# EAGLE design mod_sens (EAGLE 9.6.2)
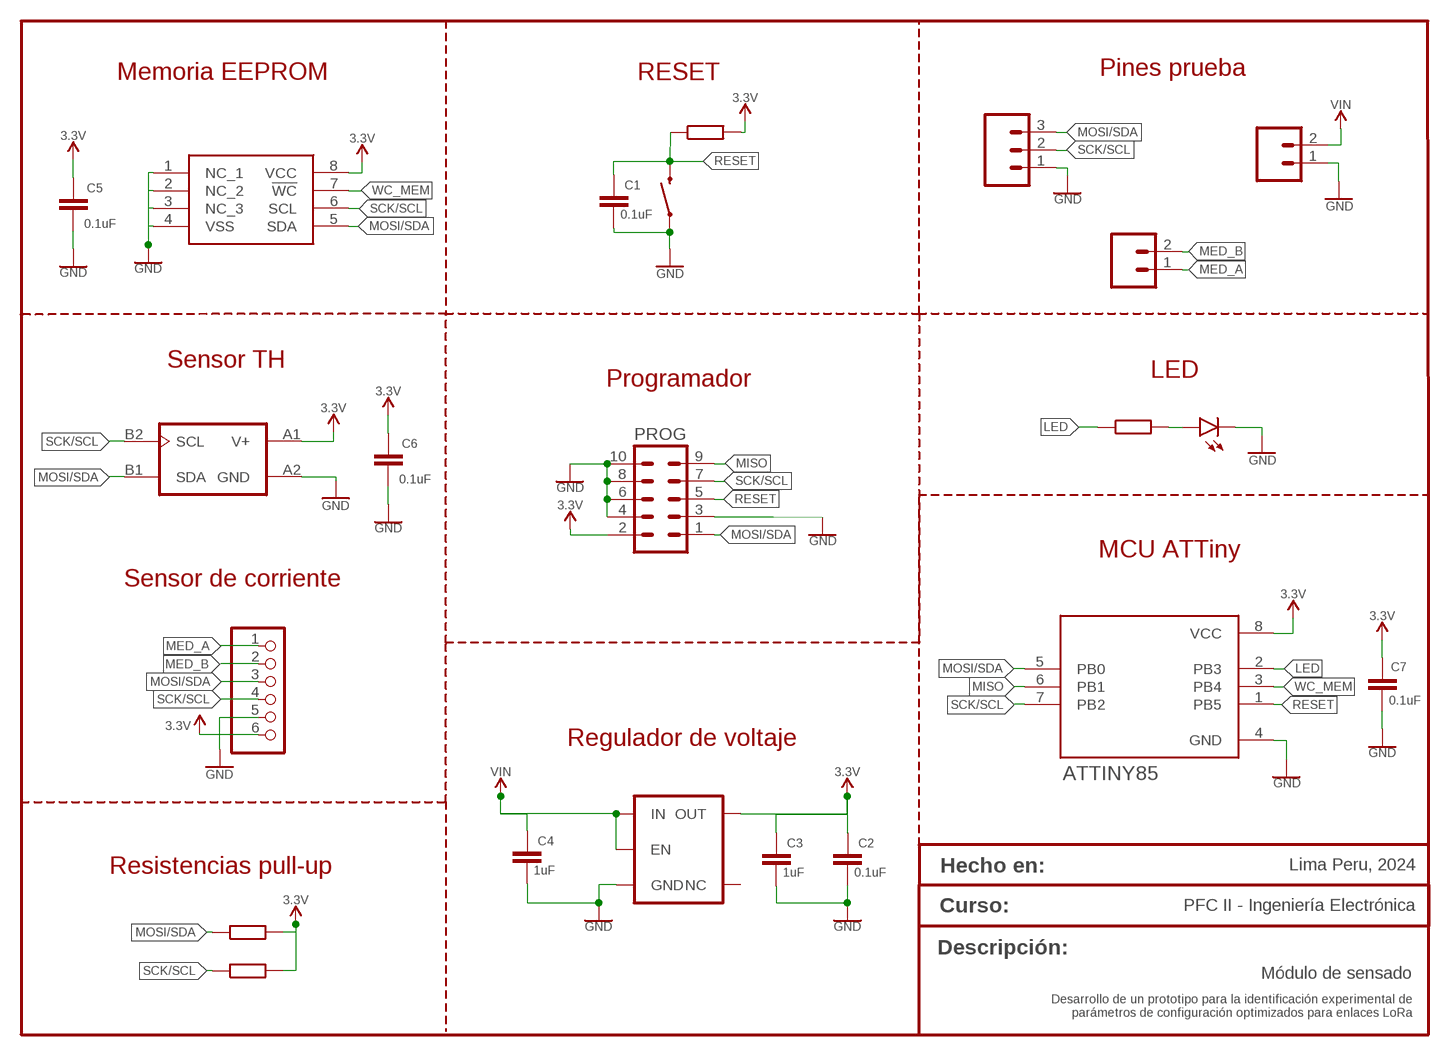
[diagram p0: schematic, sheet 1]

## Parts
ATTINY85  ATTINY85  ATTINY85-20SU  [SOIC127P798X216-8N]
C1  0.1uF  C-EUC0603K  [C0603K]
C2  0.1uF  C-EUC0603K  [C0603K]
C3  1uF  C-EUC0603K  [C0603K]
C4  1uF  C-EUC0603K  [C0603K]
C5  0.1uF  0.1UF-0603-25V-(+80/-20%)  [0603]
C6  0.1uF  0.1UF-0603-25V-(+80/-20%)  [0603]
C7  0.1uF  0.1UF-0603-25V-(+80/-20%)  [0603]
CURR  curr  CONN_02  [1X02]
CURR1  curr  CONN_02  [1X02]
I2C  i2c  CONN_03  [1X03]
L_ON  LED_3MM  [LEDRD254W50D405H1055]
MEMORIA  M24M01E  M24M01E-FMN6TP  [SOIC127P600X175-8N]
PROG  ML10-3M  [3M_10]
R1  68  R-EU_0207/10  [0207/10]
R2  1.5k  R-EU_0207/10  [0207/10]
R3  1.5k  R-EU_0207/10  [0207/10]
R4  10k  R-EU_0207/10  [0207/10]
RESET  MOMENTARY-SWITCH-SPST-PTH-6.0MM  [TACTILE_SWITCH_PTH_6.0MM]
SENSOR_CURR  sens_curr  PINHD-1X6  [1X06]
SENSOR_TH  TMP103GYFFR  [IC_TMP103DYFFR]
VOLT  3.3V  V_REG_AP2112K-3.3V  [SOT23-5]

## Nets
3.3V: ATTINY85.8(VCC) C2.1 C3.1 C5.1 C6.1 C7.1 MEMORIA.8(VCC) PROG.2 R2.2 R3.2 R4.2 SENSOR_CURR.6 SENSOR_TH.A1(V+) VOLT.5(OUT)
GND: ATTINY85.4(GND) C1.2 C2.2 C3.2 C4.2 C5.2 C6.2 C7.2 CURR1.1 I2C.1 L_ON.C MEMORIA.1(NC_1) MEMORIA.2(NC_2) MEMORIA.3(NC_3) MEMORIA.4(VSS) PROG.3 PROG.4 PROG.6 PROG.8 PROG.10 RESET.1 SENSOR_CURR.5 SENSOR_TH.A2(GND) VOLT.2(GND)
LED: ATTINY85.2(PB3) R1.1
MED_A: CURR.1 SENSOR_CURR.1
MED_B: CURR.2 SENSOR_CURR.2
MISO: ATTINY85.6(PB1) PROG.9
MOSI/SDA: ATTINY85.5(PB0) I2C.3 MEMORIA.5(SDA) PROG.1 R2.1 SENSOR_CURR.3 SENSOR_TH.B1(SDA)
N$1: L_ON.A R1.2
RESET: ATTINY85.1(PB5) C1.1 PROG.5 R4.1 RESET.3
SCK/SCL: ATTINY85.7(PB2) I2C.2 MEMORIA.6(SCL) PROG.7 R3.1 SENSOR_CURR.4 SENSOR_TH.B2(SCL)
VIN [power]: C4.1 CURR1.2 VOLT.1(IN) VOLT.3(EN)
WC_MEM: ATTINY85.3(PB4) MEMORIA.7(!WC)
Unconnected: VOLT.4(NC)

## Notes on the sheet
- Memoria EEPROM | RESET | Pines prueba
- Sensor TH
- LED
- Programador
- MCU ATTiny
- Sensor de corriente
- Regulador de voltaje
- Resistencias pull-up
- Hecho en: | Lima Peru, 2024
- Curso: | PFC II - Ingeniería Electrónica
- Descripción:
- Módulo de sensado
- Desarrollo de un prototipo para la identificación experimental de
  parámetros de configuración optimizados para enlaces LoRa

## Library data of the parts
ATTINY85 = ATTINY85-20SU:ATTINY85-20SU: AVR AVR® ATtiny, Functional Safety (FuSa) Microcontroller IC 8-Bit 20MHz 8KB (4K x 16) FLASH 8-SOIC Check availability <https://pricing.snapeda.com/parts/ATTINY85-20SU/Microchip/view-part?ref=eda>; AVAILABILITY: In Stock; CHECK_PRICES: https://www.snapeda.com/parts/ATTINY85-20SU/Microchip/view-part/?ref=eda; DESCRIPTION: AVR AVR® ATtiny, Functional Safety (FuSa) Microcontroller IC 8-Bit 20MHz 8KB (4K x 16) FLASH 8-SOIC; MF: Microchip; MP: ATTINY85-20SU; PACKAGE: SOIC-8 Microchip; PRICE: None; SNAPEDA_LINK: https://www.snapeda.com/parts/ATTINY85-20SU/Microchip/view-part/?ref=snap
C1-C4 = rcl:C-EU: CAPACITOR, European symbol; SPICEPREFIX: C
C5-C7 = SparkFun-Capacitors:0.1UF: 0.1µF ceramic capacitors A capacitor is a passive two-terminal electrical component used to store electrical energy temporarily in an electric field.; PROD_ID: CAP-00810
CURR CURR1 = SparkFun-Connectors:CONN_02: Multi connection point. Often used as Generic Header-pin footprint for 0.1 inch spaced/style header connections On any of the 0.1 inch spaced packages, you can populate with these: Break Away Headers - Straight <https://www.sparkfun.com/products/116> (PRT-00116) Break Away Male Headers - Right Angle <https://www.sparkfun.com/products/553> (PRT-00553) Female Headers <https://www.sparkfun.com/products/115> (PRT-00115) Break Away Headers - Machine Pin <https://www.sparkfun.com/products/117> (PRT-00117) Break Away Female Headers - Swiss Machine Pin <https://www.sparkfun.com/products/743> (PRT-00743) For SCREWTERMINALS and SPRING TERMINALS visit here: Screw Terimnals on SparkFun.com <https://www.sparkfun.com/search/results?term=Screw+Terminals> (5mm/3.5mm/2.54mm spacing) This device is also useful as a general connection point to wire up your design to another part of your project. Our various solder wires solder well into these plated through hole pads. Hook-Up Wire - Assortment (Stranded, 22 AWG) <https://www.sparkfun.com/products/11375> (PRT-11375) Hook-Up Wire - Assortment (Solid Core, 22 AWG) <https://www.sparkfun.com/products/11367> (PRT-11367) View the entire wire category on our website here <https://www.sparkfun.com/categories/141> Special notes: Molex polarized connector foot print use with: PRT-08233 with associated crimp pins and housings. 2.54_SCREWTERM for use with PRT-10571. 3.5mm Screw Terminal footprints for PRT-08084 5mm Screw Terminal footprints for use with PRT-08432
I2C = SparkFun-Connectors:CONN_03: Multi connection point. Often used as Generic Header-pin footprint for 0.1 inch spaced/style header connections On any of the 0.1 inch spaced packages, you can populate with these: Break Away Headers - Straight <https://www.sparkfun.com/products/116> (PRT-00116) Break Away Male Headers - Right Angle <https://www.sparkfun.com/products/553> (PRT-00553) Female Headers <https://www.sparkfun.com/products/115> (PRT-00115) Break Away Headers - Machine Pin <https://www.sparkfun.com/products/117> (PRT-00117) Break Away Female Headers - Swiss Machine Pin <https://www.sparkfun.com/products/743> (PRT-00743) Stackable Header - 3 Pin (Female, 0.1") <https://www.sparkfun.com/products/13875> (PRT-13875) For SCREWTERMINALS and SPRING TERMINALS visit here: Screw Terimnals on SparkFun.com <https://www.sparkfun.com/search/results?term=Screw+Terminals> (5mm/3.5mm/2.54mm spacing) This device is also useful as a general connection point to wire up your design to another part of your project. Our various solder wires solder well into these plated through hole pads. Hook-Up Wire - Assortment (Stranded, 22 AWG) <https://www.sparkfun.com/products/11375> (PRT-11375) Hook-Up Wire - Assortment (Solid Core, 22 AWG) <https://www.sparkfun.com/products/11367> (PRT-11367) View the entire wire category on our website here <https://www.sparkfun.com/categories/141> Special notes: Molex polarized connector foot print use with SKU : PRT-08232 with associated crimp pins and housings.; PROD_ID: XXX-00000; VALUE: 455-1750-1-ND
L_ON = LED_3MM:LED_3MM
MEMORIA = M24M01E-FMN6TP:M24M01E-FMN6TP: 1 Mbit Serial I2C bus EEPROM with configurable device address and software write protection registers Source: Datasheet <https://www.st.com/resource/en/datasheet/m24m01e-f.pdf>; DESCRIPTION: 1 Mbit Serial I2C bus EEPROM with configurable device address and software write protection registers; HEIGHT: 1.75mm; MANUFACTURER_NAME: STMicroelectronics; MANUFACTURER_PART_NUMBER: M24M01E-FMN6TP; MOUSER_PART_NUMBER: 511-M24M01E-FMN6TP; MOUSER_PRICE-STOCK: https://www.mouser.co.uk/ProductDetail/STMicroelectronics/M24M01E-FMN6TP?qs=1Kr7Jg1SGW8I5RljfIUeLw%3D%3D
PROG = con-harting-ml:ML10: HARTING; OC_FARNELL: unknown; OC_NEWARK: unknown
R1-R4 = rcl:R-EU_: RESISTOR, European symbol; SPICEPREFIX: R
RESET = SparkFun-Switches:MOMENTARY-SWITCH-SPST: Momentary Switch (Pushbutton) - SPST Normally-open (NO) SPST momentary switches (buttons, pushbuttons). Variants PTH-12MM - 12mm square, through-hole Momentary Pushbutton Switch - 12mm Square <https://www.sparkfun.com/products/9190> (COM-09190) PTH-6.0MM, PTH-6.0MM-KIT - 6.0mm square, through-hole Mini Pushbutton Switch <https://www.sparkfun.com/products/97> (COM-00097) KIT package intended for soldering kit's - only one side of pads' copper is exposed. PTH-RIGHT-ANGLE-KIT - Right-angle, through-hole Right Angle Tactile Button <https://www.sparkfun.com/products/10791> - Used on SparkFun BigTime Watch Kit <https://www.sparkfun.com/products/11734> SMD-12MM - 12mm square, surface-mount Tactile Button - SMD (12mm) <https://www.sparkfun.com/products/12993> (COM-12993) Used on SparkFun PicoBoard <https://www.sparkfun.com/products/11888> SMD-4.5MM - 4.5mm Square Trackball Switch Used on SparkFun Blackberry Trackballer Breakout <https://www.sparkfun.com/products/13169> SMD-4.6MMX2.8MM - 4.60mm x 2.80mm, surface mount Used on SparkFun Pro Micro - RP2040 <https://www.sparkfun.com/products/17717> SMD-5.2MM, SMD-5.2-REDUNDANT - 5.2mm square, surface-mount Mini Pushbutton Switch - SMD <https://www.sparkfun.com/products/8720> (COM-08720) Used on Arduino Pro Mini <https://www.sparkfun.com/products/11114> REDUNDANT package connects both switch circuits together SMD-6.0X3.5MM - 6.0 x 3.5mm, surface mount Momentary Reset Switch SMD <https://www.sparkfun.com/products/8229> (COM-08229) SMD-6.2MM-TALL - 6.2mm square, surface mount Tactile Button - SMD (6mm) <https://www.sparkfun.com/products/12992> Used on SparkFun Digital Sandbox <https://www.sparkfun.com/products/12651> SMD-RIGHT-ANGLE - Right-angle, surface mount Used on SparkFun Block for Intel® Edison - Arduino <https://www.sparkfun.com/products/13036>; PROD_ID: SWCH-08441; SF_SKU: COM-00097
SENSOR_CURR = pinhead:PINHD-1X6: PIN HEADER
SENSOR_TH = TMP103GYFFR:TMP103GYFFR: None Check availability <https://pricing.snapeda.com/parts/TMP103GYFFR/Texas%20Instruments/view-part?ref=eda>; AVAILABILITY: In Stock; CHECK_PRICES: https://www.snapeda.com/parts/TMP103GYFFR/Texas+Instruments/view-part/?ref=eda; DESCRIPTION: &plusmn;2&deg;C Digital temperature sensor with I2C/SMBus capable of 1.4V in WCSP; MF: Texas Instruments; MP: TMP103GYFFR; PACKAGE: BGA-4 Texas Instruments; PRICE: None; PURCHASE-URL: https://www.snapeda.com/api/url_track_click_mouser/?unipart_id=4805950&manufacturer=Texas Instruments&part_name=TMP103GYFFR&search_term=None; SNAPEDA_LINK: https://www.snapeda.com/parts/TMP103GYFFR/Texas+Instruments/view-part/?ref=snap
VOLT = SparkFun-IC-Power:V_REG_AP2112: AP2112 - 600mA CMOS LDO Regulator w/ Enable The AP2112 is CMOS process low dropout linear regulator with enable function, the regulator delivers a guaranteed 600mA (min.) continuous load current. Features Output Voltage Accuracy: ±1.5% Output Current: 600mA (Min.) Foldback Short Current Protection: 50mA Enable Function to Turn ON/OFF VOUT Low Dropout Voltage (3.3V): 250mV (Typ.) @IOUT=600mA Excellent Load Regulation: 0.2%/A (Typ.) Excellent Line Regulation: 0.02%/V (Typ.) Low Quiescent Current: 55μA (Typ.) Low Standby Current: 0.01μA (Typ.) Low Output Noise: 50μVRMS PSRR: 100Hz -65dB, 1kHz -65dB OTSD Protection Stable with 1.0μF Flexible Cap: Ceramic, Tantalum and Aluminum Electrolytic Operation Temperature Range: -40°C to 85°C ESD: MM 400V, HBM 4000V; PROD_ID: VREG-12457

## Net classes
1 power: width 0.305 mm

## Board
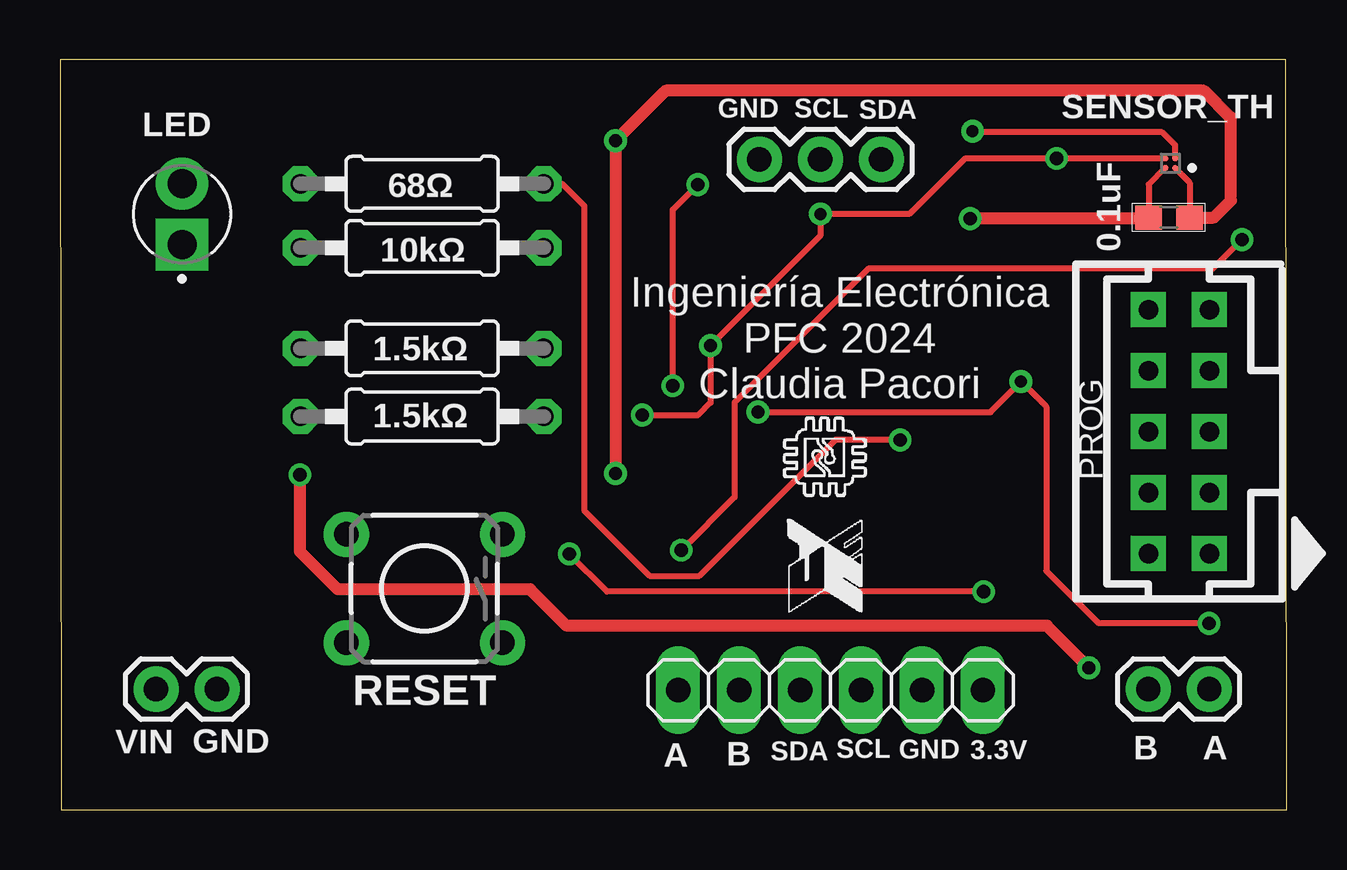
[diagram p1: board, top side]
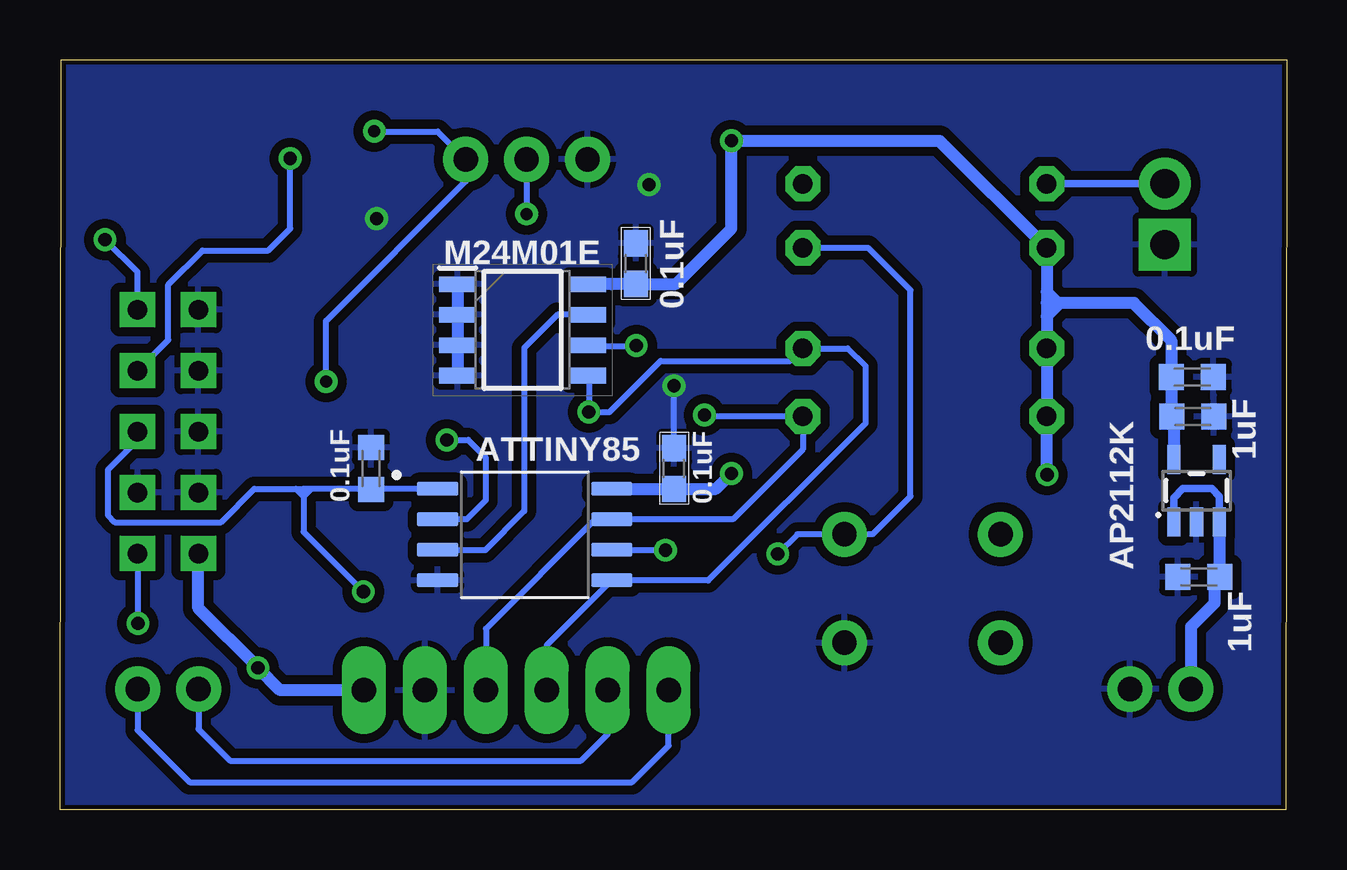
[diagram p2: board, bottom side, seen from below]

Size 51.14 x 31.26 mm. Coordinates in mm from the lower left corner, seen from the top.
Outline: 0.04,0 51.14,0 51.1,31.26 0,31.26 0.04,0
Copper layers (1*16): Top 0.035mm / dielectric 1.6mm / Bottom 0.035mm
Design rules "jlcpcb-2layers_my *": minimum track width 5mil, minimum drill 0.2mm, track to track 15mil, track to pad 15mil, pad to pad 15mil, via to via 15mil, smd to smd 5mil, copper to edge 0.2mm, drill to drill 10mil, minimum pad ring 10mil, minimum via ring 3mil, stop-mask expansion 4mil, vias tented up to drill 0.2mm, thermal gap 10mil

### Footprints (pad centres in the part's own frame; a part is rotated, then mirrored left to right if it is on the bottom)
SOIC127P798X216-8N = smd 1.71 x 0.58: 1 -3.63,1.905; 2 -3.63,0.635; 3 -3.63,-0.635; 4 -3.63,-1.905; 5 3.63,-1.905; 6 3.63,-0.635; 7 3.63,0.635; 8 3.63,1.905
C0603K = smd 1.05 x 1.08: 1 -0.875,0; 2 0.875,0
0603 = smd 1.1 x 1: 1 -0.85,0; 2 0.85,0
1X02 = drill 1.016 pad 1.88: 1 0,0; 2 2.54,0
1X03 = drill 1.016 pad 1.88: 1 0,0; 2 2.54,0; 3 5.08,0
LEDRD254W50D405H1055 = drill 1.21: A 1.27,0 | drill 1.21 square: C -1.27,0
SOIC127P600X175-8N = smd 1.525 x 0.65: 1 -2.712,1.905; 2 -2.712,0.635; 3 -2.712,-0.635; 4 -2.712,-1.905; 5 2.712,-1.905; 6 2.712,-0.635; 7 2.712,0.635; 8 2.712,1.905
3M_10 = drill 0.813 square: 1 -5.08,-1.27; 2 -5.08,1.27; 3 -2.54,-1.27; 4 -2.54,1.27; 5 0,-1.27; 6 0,1.27; 7 2.54,-1.27; 8 2.54,1.27; 9 5.08,-1.27; 10 5.08,1.27
0207/10 = drill 0.813 octagon: 1 -5.08,0; 2 5.08,0
TACTILE_SWITCH_PTH_6.0MM = drill 1.016 pad 1.88: 1 -3.251,2.261; 2 3.251,2.261; 3 -3.251,-2.261; 4 3.251,-2.261
1X06 = drill 1.016 long: 1 -6.35,0; 2 -3.81,0; 3 -1.27,0; 4 1.27,0; 5 3.81,0; 6 6.35,0
IC_TMP103DYFFR = smd 0.23 x 0.23: A1 -0.2,0.2; A2 0.2,0.2; B1 -0.2,-0.2; B2 0.2,-0.2
SOT23-5 = smd 0.55 x 1.2: 1 -0.95,-1.3; 2 0,-1.3; 3 0.95,-1.3; 4 0.95,1.3; 5 -0.95,1.3

### Placement (x,y rotation side)
ATTINY85  31.77,11.47 0 bottom
C1  38.18,14.23 90 bottom
C2  3.95,18.04 0 bottom
C3  3.92,16.39 0 bottom
C4  3.67,9.71 180 bottom
C5  27.14,22.77 90 bottom
C6  46.23,24.69 180 top
C7  25.54,14.22 90 bottom
CURR  47.9,5.03 180 top
CURR1  6.54,5.03 180 top
I2C  29.15,27.11 0 top
L_ON  5.09,24.83 90 top
MEMORIA  31.86,20 0 bottom
PROG  46.64,15.76 90 top
R1  15.09,26.09 180 top
R2  15.09,19.23 180 top
R3  15.09,16.39 180 top
R4  15.09,23.42 180 top
RESET  15.19,9.22 180 top
SENSOR_CURR  32.12,4.98 0 top
SENSOR_TH  46.28,26.95 180 top
VOLT  3.77,13.3 0 bottom

### Tracks (layer width: path | path; a pad name or v marks a point on that pad's centre or on a via)
3.3V  (via drill 0.55 pad 0.95)
  Top 0.254: SENSOR_TH.A1 47.09,26.14 47.09,24.71 C6.1
  Top 0.508: C6.1 48.1,24.69 48.81,25.4 48.81,28.85 47.69,29.97 25.24,29.97 v23.16,27.89 23.16,27.88 23.16,14.03 v23.16,14.02 | v42.89,5.92 41.14,7.67 21.12,7.67 19.6,9.2 11.57,9.2 10,10.77 v10,13.97
  Bottom 0.508: 10.01,21.59 R4.2 14.48,27.89 v23.16,27.89 23.16,24.23 25.47,21.92 C5.1 28.15,21.91 MEMORIA.8 | 10.01,21.59 10.01,21.13 | 10.01,21.13 10.01,20.57 | 10.01,20.57 R2.2 R3.2 10,16.38 v10,13.97 | 10.01,21.13 9.55,21.13 | 9.46,21.13 6.38,21.13 4.82,19.57 C2.1 4.82,16.42 C3.1 4.72,16.32 VOLT.5 | 10.01,21.59 9.55,21.13 | 9.55,21.13 9.46,21.13 | 10.01,20.57 9.46,21.13 | ATTINY85.8 C7.1 23.8,13.37 v23.16,14.02 | SENSOR_CURR.6 41.95,4.98 v42.89,5.92 45.37,8.4 PROG.2
GND  (via drill 0.55 pad 0.95)
  Top 0.254: SENSOR_TH.A2 46.06,26.75 45.38,26.07 C6.2 | v25.54,17.68 25.54,25.02 v26.58,26.06
  Top 0.508: C6.2 45.32,24.64 v37.94,24.64
  Bottom 0.254: C7.2 v25.54,17.68
  Bottom 0.508: MEMORIA.1 MEMORIA.2 MEMORIA.3 MEMORIA.4
  pour Bottom: -0.72,32 -0.72,-1.42 52.31,-1.42 52.31,32
LED  (via drill 0.55 pad 0.95)
  Top 0.254: v35.02,15.42 32.32,15.42 26.66,9.75 24.58,9.75 21.85,12.48 21.85,25.18 20.94,26.09 R1.1
  Bottom 0.254: ATTINY85.2 34.19,12.11 33.39,12.9 33.39,14.68 34.13,15.42 v35.02,15.42
MED_A
  Bottom 0.254: CURR.1 47.9,3.31 45.74,1.15 27.29,1.15 25.77,2.67 SENSOR_CURR.1
MED_B
  Bottom 0.254: CURR.2 45.36,3.37 45.37,3.37 44.05,2.04 29.42,2.04 28.31,3.15 SENSOR_CURR.2
MISO  (via drill 0.55 pad 0.95)
  Top 0.254: v49.27,23.77 48.05,22.55 33.69,22.55 28.12,16.98 28.12,13.04 v25.9,10.82
  Bottom 0.254: ATTINY85.6 25.91,10.84 v25.9,10.82 | PROG.9 47.91,22.42 v49.27,23.77
MOSI/SDA  (via drill 0.5 pad 0.95, 0.55 pad 0.95)
  Top 0.254: v38.04,28.3 38.09,28.25 45.95,28.25 46.48,27.71 SENSOR_TH.B1 | v29.1,16.58 38.78,16.58 v40.05,17.85 40.08,17.85 41.11,16.82 41.11,9.96 43.3,7.77 v47.9,7.77
  Bottom 0.254: v38.04,28.3 38.02,28.27 35.39,28.27 I2C.3 34.23,26.2 40.05,20.38 v40.05,17.85 | MEMORIA.5 29.1,18.05 v29.1,16.58 28.24,16.58 26.1,18.71 20.7,18.71 R2.1 18.31,19.23 17.57,18.49 17.57,16.1 24.12,9.55 28.13,9.55 ATTINY85.5 30.85,6.86 SENSOR_CURR.3 | PROG.1 47.91,7.79 v47.9,7.77
N$1
  Bottom 0.254: R1.2
  Bottom 0.305: L_ON.A R1.2
RESET  (via drill 0.55 pad 0.95)
  Top 0.254: v38.5,9.09 22.8,9.09 v21.23,10.67
  Bottom 0.254: R4.1 17.45,23.43 15.69,21.66 15.69,13.07 17.27,11.48 RESET.3 20.41,11.48 v21.23,10.67 | ATTINY85.1 38.14,13.38 | 38.14,13.38 C1.1 | 41.31,13.38 43.04,13.38 44.43,11.98 48.85,11.98 49.15,12.28 49.15,14.17 47.91,15.41 PROG.5 | 41.31,13.38 40.99,13.38 | 38.14,13.38 40.67,13.38 | 40.67,13.38 40.99,13.38 | 40.99,13.38 40.99,13.06 | 40.99,13.06 40.99,11.58 v38.5,9.09 | 40.99,13.06 40.67,13.38 | 40.99,13.06 41.31,13.38
SCK/SCL  (via drill 0.5 pad 0.95, 0.55 pad 0.95)
  Top 0.254: SENSOR_TH.B2 v41.55,27.15 37.72,27.15 35.41,24.83 v31.7,24.83 v31.69,24.84 31.69,23.93 v27.12,19.36 27.12,16.97 26.61,16.46 v24.27,16.46
  Bottom 0.254: I2C.2 v31.69,24.84 | MEMORIA.6 29.15,19.27 29,19.27 29.05,19.32 27.15,19.32 v27.12,19.36 | PROG.7 46.63,19.59 46.63,21.89 45.2,23.32 42.46,23.32 41.55,24.23 v41.55,27.15 | SENSOR_CURR.4 33.39,7.54 28.83,12.11 ATTINY85.7 23.09,12.11 20.17,15.02 R3.1 24.21,16.39 v24.27,16.46
VIN
  Bottom 0.305: VOLT.3 2.82,13.06 3.14,13.39 4.33,13.39 4.72,13 VOLT.1
  Bottom 0.508: CURR1.2 4,7.63 3.02,8.61 3.02,9.48 C4.1 2.82,9.73 VOLT.3
WC_MEM
  Bottom 0.254: MEMORIA.7 30.4,20.64 31.79,19.25 31.79,12.45 33.42,10.82 35.39,10.82 ATTINY85.3

### Text on the board
tPlace: GND | SCL | SDA | LED | 68Ω | 0.1uF | 10kΩ | 1.5kΩ | 1.5kΩ | Ingeniería Electrónica / PFC 2024 / Claudia Pacori | PROG | VIN | GND | A | B | 3.3V | B | A | SDA | SCL | GND
bPlace: M24M01E | 0.1uF | 0.1uF | 1uF | ATTINY85 | 0.1uF | 0.1uF | AP2112K | 1uF